# Altium schematic sheet PAGE2 - STM NUCLEO OTII TC.SchDoc
size A3
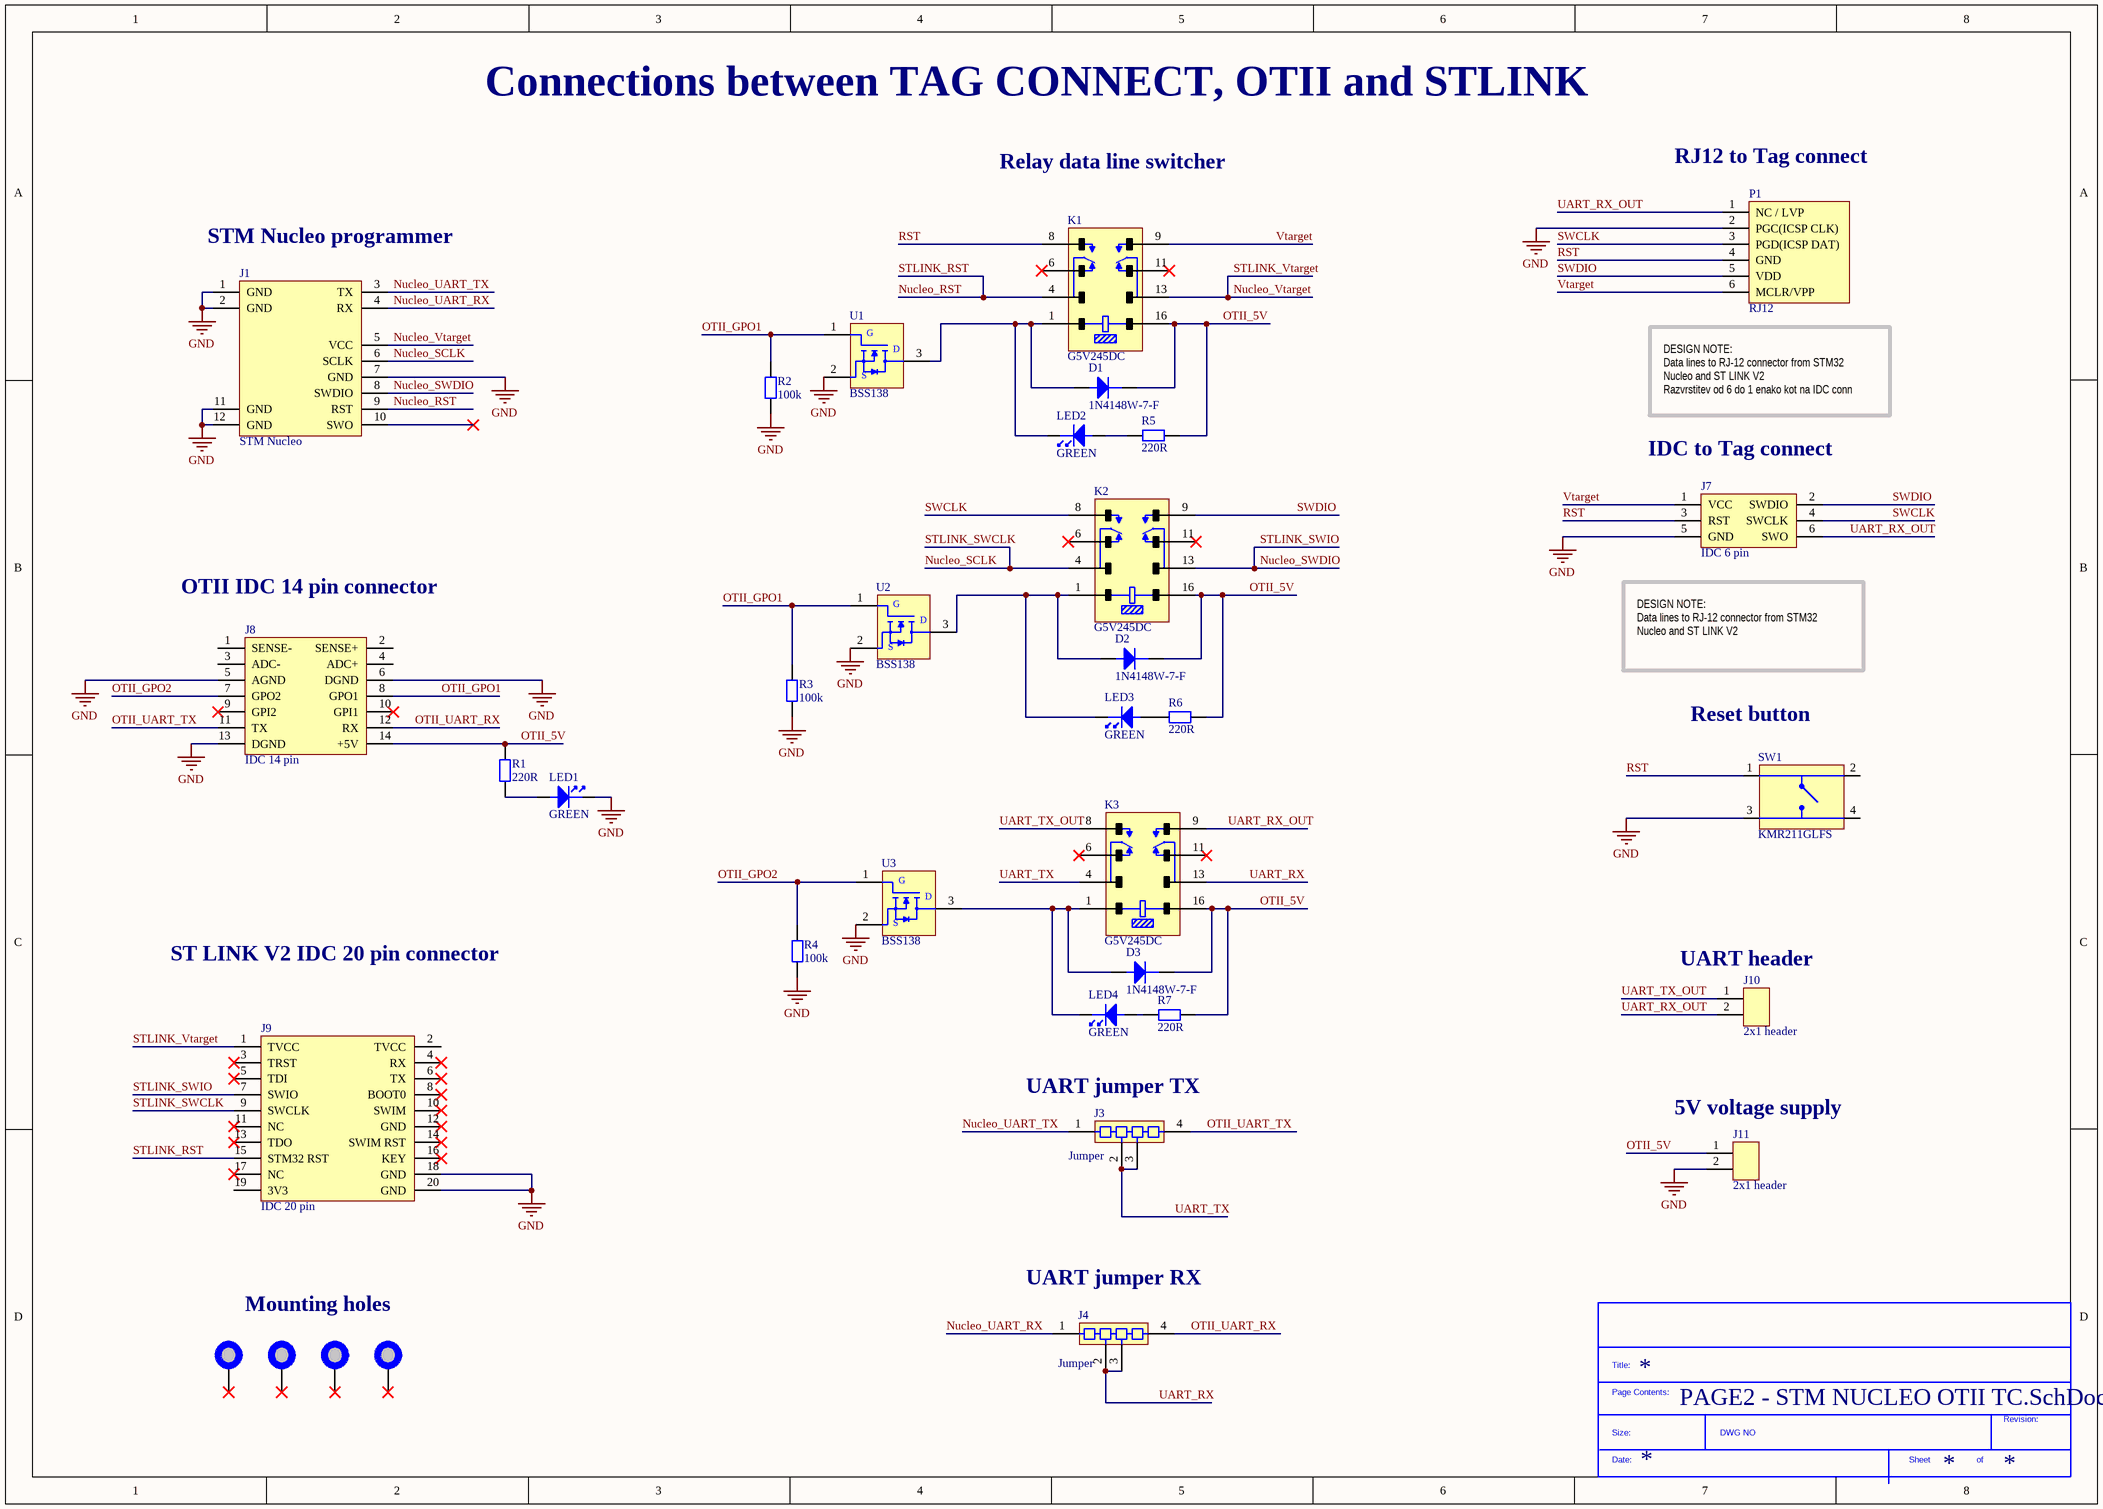
[diagram p0: PAGE2 - STM NUCLEO OTII TC.SchDoc]

## Parts
(Parts that share a designator on the sheet are numbered #1, #2 ... from top to bottom, then left to right.)
*#1  Mounting hole 3.3 mm  [MH_3.3]  (value not drawn)
*#2  Mounting hole 3.3 mm  [MH_3.3]  (value not drawn)
*#3  Mounting hole 3.3 mm  [MH_3.3]  (value not drawn)
*#4  Mounting hole 3.3 mm  [MH_3.3]  (value not drawn)
*?  SDTitleBlock  (value not drawn)  (graphical)
D1  1N4148W-7-F  [1N4148W-7-F]
D2  1N4148W-7-F  [1N4148W-7-F]
D3  1N4148W-7-F  [1N4148W-7-F]
J1  STM Nucleo  [NUCLEO F4 HEADERS]
J3  Jumper  [jumper4]
J4  Jumper  [jumper4]
J7  IDC 6 pin  [IDC 6 pin]
J8  IDC 14 pin  [IDC 14 PIN]
J9  IDC 20 pin  [IDC 20 pin]
J10  2x1 header  [2 pin]
J11  2x1 header  [2 pin]
K1  G5V245DC  [G5V245DC]
K2  G5V245DC  [G5V245DC]
K3  G5V245DC  [G5V245DC]
LED1  GREEN  [LED 0603]
LED2  GREEN  [LED 0603]
LED3  GREEN  [LED 0603]
LED4  GREEN  [LED 0603]
P1  RJ12  [RJ12]
R1  220R  [R0603]
R2  100k  [R0603]
R3  100k  [R0603]
R4  100k  [R0603]
R5  220R  [R0603]
R6  220R  [R0603]
R7  220R  [R0603]
SW1  KMR211GLFS  [Button]
U1  BSS138  [BSS138]
U2  BSS138  [BSS138]
U3  BSS138  [BSS138]

## Nets
GND: J1.1(GND) J1.2(GND) J1.7(GND) J1.11(GND) J1.12(GND) J7.5(GND) J8.5(AGND) J8.6(DGND) J8.13(DGND) J9.18(GND) J9.20(GND) J11.2 LED1.1(Cathode) P1.2(PGC(ICSP_CLK)) R2.1 R3.1 R4.1 SW1.3 U1.2(S) U2.2(S) U3.2(S)
Nucleo_RST: J1.9(RST) J9.15(STM32_RST) K1.4  [also labelled STLINK_RST]
Nucleo_SCLK: J1.6(SCLK) J9.9(SWCLK) K2.4  [also labelled STLINK_SWCLK]
Nucleo_SWDIO: J1.8(SWDIO) J9.7(SWIO) K2.13  [also labelled STLINK_SWIO]
Nucleo_UART_RX: J1.4(RX) J4.1
Nucleo_UART_TX: J1.3(TX) J3.1
Nucleo_Vtarget: J1.5(VCC) J9.1(TVCC) K1.13  [also labelled STLINK_Vtarget]
OTII_5V: D1.1(Cathode) D2.1(Cathode) D3.1(Cathode) J8.14(+5V) J11.1 K1.16 K2.16 K3.16 R1.2 R5.1 R6.1 R7.2
OTII_GPO1: J8.8(GPO1) R2.2 R3.2 U1.1(G) U2.1(G)
OTII_GPO2: J8.7(GPO2) R4.2 U3.1(G)
OTII_UART_RX: J4.4 J8.12(RX)
OTII_UART_TX: J3.4 J8.11(TX)
RST: J7.3(RST) K1.8 P1.4(GND) SW1.1
SWCLK: J7.4(SWCLK) K2.8 P1.3(PGD(ICSP_DAT))
SWDIO: J7.2(SWDIO) K2.9 P1.5(VDD)
UART_RX: J4.2 J4.3 K3.13
UART_RX_OUT: J7.6(SWO) J10.2 K3.9 P1.1(NC_/_LVP)
UART_TX: J3.2 J3.3 K3.4
UART_TX_OUT: J10.1 K3.8
Vtarget: J7.1(VCC) K1.9 P1.6(MCLR/VPP)
NetD1_2: D1.2(Anode) K1.1 LED2.1(Cathode) U1.3(D)
NetD2_2: D2.2(Anode) K2.1 LED3.1(Cathode) U2.3(D)
NetD3_2: D3.2(Anode) K3.1 LED4.1(Cathode) U3.3(D)
NetLED1_2: LED1.2(Anode) R1.1
NetLED2_2: LED2.2(Anode) R5.2
NetLED3_2: LED3.2(Anode) R6.2
NetLED4_2: LED4.2(Anode) R7.1

Not connected (* = marked no-connect by the designer): *#1 1*; *#2 1*; *#3 1*; *#4 1*; J1 10(SWO)*; J8 1(SENSE-) 2(SENSE+) 3(ADC-) 4(ADC+) 9(GPI2)* 10(GPI1)*; J9 2(TVCC) 3(TRST)* 4(RX)* 5(TDI)* 6(TX)* 8(BOOT0)* 10(SWIM)* 11(NC)* 12(GND)* 13(TDO)* 14(SWIM_RST)* 16(KEY)* 17(NC)* 19(3V3); K1 6* 11*; K2 6* 11*; K3 6* 11*; SW1 2 4

## Notes on the sheet
- Connections between TAG CONNECT, OTII and STLINK
- Relay data line switcher
- (near P1) RJ12 to Tag connect
- (near J1) STM Nucleo programmer
- (near P1) DESIGN NOTE:
  Data lines to RJ-12 connector from STM32 Nucleo and ST LINK V2
  Razvrstitev od 6 do 1 enako kot na IDC conn
- (near J7) IDC to Tag connect
- (near J8) OTII IDC 14 pin connector
- DESIGN NOTE:
  Data lines to RJ-12 connector from STM32 Nucleo and ST LINK V2
- (near SW1) Reset button
- ST LINK V2 IDC 20 pin connector
- (near J10) UART header
- (near J3) UART jumper TX
- (near J11) 5V voltage supply
- (near *#2) Mounting holes
- (near J4) UART jumper RX
- (in symbol SDTitleBlock) Title:; Page Contents:; Revision:; Size:; DWG NO; Date:; Sheet; of

## Library data of the parts
*#1-*#4 = MH_3_3
D1-D3 = 1N4148W-7-F: DIODE GEN PURP 100V 300MA SOD123; Manufacturer: Diodes; Current Rating: 150mA; Max Surge Current: 2A; Peak Reverse Current: 1uA; Recovery Time: 4ns; Forward Voltage: 1.25V; Power Dissipation: 400mW; Element Configuration: Single; Polarity: Standard; Voltage Rating (DC): 75V; Capacitance: 2pF; Supplier 1: Farnell; Manufacturer Part Number: 1N4148W-7-F; Stock 1: 994731; Pricing 1: 5=0.155, 25=0.151, 100=0.0525, 250=0.0496, 500=0.0474, 1000=0.0247, 5000=0.0213 (EUR); Mount: Surface Mount; Number of Pins: 2; Weight: 0.000353oz; Contact Plating: Tin,Matte; Min Operating Temperature: -65°C; Max Operating Temperature: 150°C; Package Quantity: 3000; Packaging: Tape and Reel; Voltage: 100V; Forward Current: 150mA; Average Rectified Current: 300mA; Reverse Recovery Time: 4ns; Max Repetitive Reverse Voltage (Vrrm): 100V; Max Forward Surge Current (Ifsm): 2A; Peak Non-Repetitive Surge Current: 2A; Power Rating: 400mW; Output Current: 150mA; Max Reverse Voltage (DC): 100V; Length: 2.85mm; Height: 1.25mm; Width: 1.7mm; Radiation Hardening: No; Lead Free: Lead Free; REACH SVHC: No SVHC; ComponentLink1URL: https://www.diodes.com/assets/Datasheets/ds30086.pdf?src-supplier=Digi-Key; ComponentLink1Description: https://www.diodes.com/assets/Datasheets/ds30086.pdf?src-supplier=Digi-Key; ComponentLink2URL: http://www.farnell.com/datasheets/1915529.pdf?src-supplier=Element14; ComponentLink2Description: http://www.farnell.com/datasheets/1915529.pdf?src-supplier=Element14; ComponentLink3URL: https://www.diodes.com/assets/Datasheets/ds30086.pdf?src-supplier=Avnet; ComponentLink3Description: https://www.diodes.com/assets/Datasheets/ds30086.pdf?src-supplier=Avnet; ComponentLink4URL: http://www.mouser.com/ds/2/115/ds30086-60872.pdf?src-supplier=Mouser; ComponentLink4Description: http://www.mouser.com/ds/2/115/ds30086-60872.pdf?src-supplier=Mouser; ComponentLink5URL: https://www.diodes.com/assets/Datasheets/ds30086.pdf?src-supplier=Avnet+Europe; ComponentLink5Description: https://www.diodes.com/assets/Datasheets/ds30086.pdf?src-supplier=Avnet+Europe; ComponentLink6URL: https://www.diodes.com/assets/Datasheets/ds30086.pdf?src-supplier=Verical; ComponentLink6Description: https://www.diodes.com/assets/Datasheets/ds30086.pdf?src-supplier=Verical; Supplier Part Number 1: 1776392
J3 J4 = Jumper_1: 4 pin jumper
J7 = 90130-1206: Headers & Wire Housings 2.54MM CGRIDIII HDR 6P V DR SHRD AU-E; Manufacturer: Molex; Number of Contacts: 6; Max Voltage Rating (DC): 350.35kV; Contact Resistance: 20mR; Max Voltage Rating (AC): 500V; Current Rating: 3A; Voltage Rating: 350V; Max Current Rating: 3.9A; Insulation Resistance: 5GR; Gender: Male; Glow Wire Compliant: Non-compliant; Supplier 1: Farnell; Manufacturer Part Number: 90130-1206; Stock 1: 1896; Pricing 1: 1=1.07, 50=1, 100=0.934, 250=0.84, 500=0.775, 1000=0.619 (EUR); Mount: Through Hole; Contact Plating: Gold; Contact Material: Brass,Bronze,Copper; Housing Color: Black; Color: Black; Housing Material: Polyester; Material: Glass,Polyester; Min Operating Temperature: -55°C; Max Operating Temperature: 125°C; Number of Rows: 2; Termination: Solder; Packaging: Tray; Number of Positions: 6; Orientation: Vertical; Package Quantity: 2560; Number of Poles: 6; Voltage Rating (AC): 350V; Contact Gender: Male; Working Voltage: 350V; Voltage Rating (DC): 350V; Number of Circuits: 6; Length: 8mm; Height: 4.7mm; Pitch: 2.54mm; Row Spacing: 2.54mm; Depth: 3.94mm; Lead Pitch: 2.54mm; Radiation Hardening: No; REACH SVHC: Unknown; Lead Free: Lead Free; ComponentLink1URL: http://www.mouser.com/ds/2/276/0901301206_PCB_HEADERS-151694.pdf?src-supplier=Mouser; ComponentLink1Description: http://www.mouser.com/ds/2/276/0901301206_PCB_HEADERS-151694.pdf?src-supplier=Mouser; ComponentLink2URL: http://www.jameco.com/Jameco/Products/ProdDS/1978810.pdf?src-supplier=Jameco; ComponentLink2Description: http://www.jameco.com/Jameco/Products/ProdDS/1978810.pdf?src-supplier=Jameco; ComponentLink3URL: http://www.molex.com/webdocs/datasheets/pdf/en-us/0901301206_PCB_HEADERS.pdf?src-supplier=Avnet+Europe; ComponentLink3Description: http://www.molex.com/webdocs/datasheets/pdf/en-us/0901301206_PCB_HEADERS.pdf?src-supplier=Avnet+Europe; ComponentLink4URL: http://www.molex.com/webdocs/datasheets/pdf/en-us/0901301206_PCB_HEADERS.pdf?src-supplier=Avnet; ComponentLink4Description: http://www.molex.com/webdocs/datasheets/pdf/en-us/0901301206_PCB_HEADERS.pdf?src-supplier=Avnet; ComponentLink5URL: http://uk.rs-online.com/webdocs/13c4/0900766b813c4c7b.pdf?src-supplier=RSComponents; ComponentLink5Description: http://uk.rs-online.com/webdocs/13c4/0900766b813c4c7b.pdf?src-supplier=RSComponents; Supplier Part Number 1: 9733884
J8 = 70246-1404: Conn Shrouded Header (4 Sides) HDR 14 POS 2.54mm Solder ST Thru-Hole C-Grid® Frame; Manufacturer: Molex; Number of Contacts: 14; Max Voltage Rating (DC): 250V; Current Rating: 2.5A; Gender: Male; Contact Post Length: 3.43mm; Glow Wire Compliant: Non-compliant; Supplier 1: Farnell; Manufacturer Part Number: 70246-1404; Stock 1: 3001; Pricing 1: 1=1.55, 50=1.48, 100=1.42, 250=1.29, 500=1.17, 1000=0.966 (EUR); Mount: Through Hole; Contact Plating: Gold,Tin; Contact Material: Bronze,Gold; Housing Material: Polyester; Min Operating Temperature: -55°C; Max Operating Temperature: 120°C; Number of Rows: 2; Termination: Solder; Packaging: Tray; Number of Positions: 14; Orientation: Vertical; Voltage Rating: 250V; Voltage Rating (DC): 250V; Contact Gender: Male; Number of Circuits: 14; Pitch: 2.54mm; Row Spacing: 2.54mm; Contact Mating Length: 6.1mm; Radiation Hardening: No; REACH SVHC: Unknown; ELV: Compliant; Flammability Rating: UL94 V-0; ComponentLink1URL: http://www.farnell.com/datasheets/2051710.pdf?src-supplier=Element14; ComponentLink1Description: http://www.farnell.com/datasheets/2051710.pdf?src-supplier=Element14; ComponentLink2URL: http://www.molex.com/webdocs/datasheets/pdf/en-us/0702461404_PCB_HEADERS.pdf?src-supplier=Avnet; ComponentLink2Description: http://www.molex.com/webdocs/datasheets/pdf/en-us/0702461404_PCB_HEADERS.pdf?src-supplier=Avnet; ComponentLink3URL: http://uk.rs-online.com/webdocs/13c4/0900766b813c492f.pdf?src-supplier=RSComponents; ComponentLink3Description: http://uk.rs-online.com/webdocs/13c4/0900766b813c492f.pdf?src-supplier=RSComponents; ComponentLink4URL: http://www.mouser.com/ds/2/276/0702461404_PCB_HEADERS-172392.pdf?src-supplier=Mouser; ComponentLink4Description: http://www.mouser.com/ds/2/276/0702461404_PCB_HEADERS-172392.pdf?src-supplier=Mouser; ComponentLink5URL: http://www.molex.com/webdocs/datasheets/pdf/en-us/0702461404_PCB_HEADERS.pdf?src-supplier=Avnet+Europe; ComponentLink5Description: http://www.molex.com/webdocs/datasheets/pdf/en-us/0702461404_PCB_HEADERS.pdf?src-supplier=Avnet+Europe; Supplier Part Number 1: 1392520
J9 = 70246-2004: Headers & Wire Housings 2.54mm CGrid Hdr Shr d /Slt .13AuLF 20Ckt; Manufacturer: Molex; Number of Contacts: 20; Max Voltage Rating (DC): 250V; Current Rating: 2.5A; Gender: Male; Glow Wire Compliant: Non-compliant; Supplier 1: Farnell; Manufacturer Part Number: 70246-2004; Stock 1: 2985; Pricing 1: 1=1.62, 50=1.52, 100=1.41, 250=1.28, 500=1.17, 1000=0.943 (EUR); Mount: Through Hole; Contact Plating: Gold; Contact Material: Gold,Bronze; Min Operating Temperature: -55°C; Max Operating Temperature: 120°C; Number of Rows: 2; Termination: Solder; Packaging: Tray; Number of Positions: 20; Orientation: Vertical; Package Quantity: 720; Voltage Rating (DC): 250V; Voltage Rating: 250V; Number of Circuits: 20; Pitch: 2.54mm; Radiation Hardening: No; REACH SVHC: Unknown; ELV: Compliant; Flammability Rating: UL94 V-0; ComponentLink1URL: http://www.farnell.com/datasheets/2051704.pdf?src-supplier=Element14; ComponentLink1Description: http://www.farnell.com/datasheets/2051704.pdf?src-supplier=Element14; ComponentLink2URL: http://www.mouser.com/ds/2/276/0702462004_PCB_HEADERS-150189.pdf?src-supplier=Mouser; ComponentLink2Description: http://www.mouser.com/ds/2/276/0702462004_PCB_HEADERS-150189.pdf?src-supplier=Mouser; ComponentLink3URL: http://www.molex.com/webdocs/datasheets/pdf/en-us/0702462004_PCB_HEADERS.pdf?src-supplier=Avnet+Europe; ComponentLink3Description: http://www.molex.com/webdocs/datasheets/pdf/en-us/0702462004_PCB_HEADERS.pdf?src-supplier=Avnet+Europe; ComponentLink4URL: http://www.molex.com/webdocs/datasheets/pdf/en-us/0702462004_PCB_HEADERS.pdf?src-supplier=Avnet; ComponentLink4Description: http://www.molex.com/webdocs/datasheets/pdf/en-us/0702462004_PCB_HEADERS.pdf?src-supplier=Avnet; ComponentLink5URL: http://uk.rs-online.com/webdocs/13c4/0900766b813c4938.pdf?src-supplier=RSComponents; ComponentLink5Description: http://uk.rs-online.com/webdocs/13c4/0900766b813c4938.pdf?src-supplier=RSComponents; Supplier Part Number 1: 1392410
J10 J11 = 2 pin header
K1-K3 = G5V245DC: OMRON ELECTRONIC COMPONENTS         G5V-2 4.5DC            Signal Relay, G5V-2 Series, DPDT, 4.5 VDC, 2 A, Through Hole, Non Latching; Contact Current Rating: 2A; Coil Resistance: 40R; Coil Power: 500mW; Coil Voltage (DC): 4.5V; Coil Type: Non-Latching; Supplier 1: Farnell; Manufacturer: Omron; Manufacturer Part Number: G5V245DC; Stock 1: 337; Pricing 1: 1=1.89, 25=1.76, 50=1.24, 250=1.14, 500=1.12 (EUR); Mount: PCB; Contact Material: Silver,Gold; Min Operating Temperature: -25°C; Max Operating Temperature: 65°C; Termination: Through Hole; Switching Current: 2A; Length: 20.5mm; Height: 11.5mm; Depth: 10.1mm; REACH SVHC: Unknown; ComponentLink1URL: http://www.farnell.com/datasheets/724502.pdf?src-supplier=Element14; ComponentLink1Description: http://www.farnell.com/datasheets/724502.pdf?src-supplier=Element14; ComponentLink2URL: https://www.distrelec.biz/Web/Downloads/_t/ds/g5v2_eng_tds.pdf?mime=application%2Fpdf&src-supplier=Distrelec; ComponentLink2Description: https://www.distrelec.biz/Web/Downloads/_t/ds/g5v2_eng_tds.pdf?mime=application%2Fpdf&src-supplier=Distrelec; Supplier Part Number 1: 9949810
LED1-LED4 = KP-1608CGCK: KINGBRIGHT - KP-1608CGCK - LED, 0603, 50MCD, GREEN; Lens Color: Clear; Viewing Angle: 120°; Lens Style: Rectangular,Diffused,Colorless; Dominant Wavelength: 570nm; Number of LEDs: 1; Forward Voltage: 2.1V; Forward Current: 20mA; Supplier 1: Farnell; Manufacturer: Kingbright; Manufacturer Part Number: KP-1608CGCK; Stock 1: 18535; Pricing 1: 5=0.157, 50=0.143, 100=0.0934, 500=0.0789, 1000=0.0621 (EUR); Mount: Surface Mount; Case/Package: 1608; Number of Pins: 2; Color: Green; Luminous Intensity: 50mcd; Wavelength: 570nm; Packaging: Tape and Reel; Length: 0.8mm; Height: 1.1mm; Width: 1.6mm; Radiation Hardening: No; REACH SVHC: No SVHC; ComponentLink1URL: http://www.farnell.com/datasheets/2045956.pdf?src-supplier=Element14; ComponentLink1Description: http://www.farnell.com/datasheets/2045956.pdf?src-supplier=Element14; ComponentLink2URL: http://www.rapidonline.com/pdf/72-8670.pdf?src-supplier=Rapid+Electronics; ComponentLink2Description: http://www.rapidonline.com/pdf/72-8670.pdf?src-supplier=Rapid+Electronics; Supplier Part Number 1: 2290328
P1 = 95501-2661: MODULAR, JACK, THT, R/A, RJ11, 6P6C; Manufacturer: Molex; Shielding: Unshielded; Max Voltage Rating (DC): 125V; Number of Ports: 1; Current Rating: 1.5A; Gender: Female; Number of Contacts: 6; Insulation Resistance: 500MR; Pitch: 2.54mm; Approvals: UL; Supplier 1: Farnell; Manufacturer Part Number: 95501-2661; Stock 1: 7441; Pricing 1: 10=0.565, 100=0.492, 500=0.443, 1000=0.394, 2500=0.356, 5000=0.344 (EUR); Mount: Through Hole; Contact Plating: Gold; Contact Material: Copper Alloy,Bronze; Housing Material: Thermoplastic; Color: Black; Insulation Material: Polyester; Min Operating Temperature: -40°C; Max Operating Temperature: 80°C; Packaging: Tray; Package Quantity: 3276; Termination: Through Hole; Orientation: Right Angle; Voltage Rating (DC): 125V; Number of Positions: 6; Length: 13.21mm; Depth: 18.1mm; Width: 11.5mm; REACH SVHC: Unknown; Halogen Free: Low Halogen; Lead Free: Lead Free; Flammability Rating: UL94 V-0; ComponentLink1URL: http://uk.rs-online.com/webdocs/13c4/0900766b813c4eac.pdf?src-supplier=RSComponents; ComponentLink1Description: http://uk.rs-online.com/webdocs/13c4/0900766b813c4eac.pdf?src-supplier=RSComponents; ComponentLink2URL: http://www.farnell.com/cad/1597654.pdf?src-supplier=Element14; ComponentLink2Description: http://www.farnell.com/cad/1597654.pdf?src-supplier=Element14; ComponentLink3URL: http://www.mouser.com/ds/2/276/0955012661_MODULAR_JACKS_PLUG-177638.pdf?src-supplier=Mouser; ComponentLink3Description: http://www.mouser.com/ds/2/276/0955012661_MODULAR_JACKS_PLUG-177638.pdf?src-supplier=Mouser; ComponentLink4URL: http://www.onlinecomponents.com/productFiles/mf-MOL/360890955012661_modular_jacks_plug.pdf?src-supplier=Onlinecomponents.com; ComponentLink4Description: http://www.onlinecomponents.com/productFiles/mf-MOL/360890955012661_modular_jacks_plug.pdf?src-supplier=Onlinecomponents.com; Supplier Part Number 1: 1536490
R1 R5-R7 = CRCW0603220RFKEA: RES SMD 220 OHM 1% 1/10W 0603; Manufacturer: Vishay; Temperature Coefficient: 100ppm/°C; Max Power Dissipation: 100mW; Voltage Rating: 75V; Supplier 1: Digi-Key; Manufacturer Part Number: CRCW0603220RFKEA; Stock 1: 0; Case/Package: 0603; Weight: 7.1E-05oz; Contact Plating: Tin; Case Code (Metric): 1608; Case Code (Imperial): 0603; Min Operating Temperature: -55°C; Max Operating Temperature: 155°C; Composition: Thick Film; Resistance: 220R; Tolerance: 1%; Packaging: Tape and Reel; Number of Terminations: 2; Power Rating: 100mW; Package Quantity: 10; Termination: SMD/SMT; Military Standard: Not; Voltage Rating (DC): 75V; Features: Automotive AEC-Q200; Length: 1.55mm; Height: 0.45mm; Width: 0.033inch; Depth: 0.85mm; Radiation Hardening: No; REACH SVHC: Unknown; Lead Free: Lead Free; ComponentLink1URL: http://www.vishay.com/docs/20035/dcrcwe3.pdf?src-supplier=Digi-Key; ComponentLink1Description: http://www.vishay.com/docs/20035/dcrcwe3.pdf?src-supplier=Digi-Key; ComponentLink2URL: http://www.mouser.com/ds/2/427/dcrcwe3-109170.pdf?src-supplier=Mouser; ComponentLink2Description: http://www.mouser.com/ds/2/427/dcrcwe3-109170.pdf?src-supplier=Mouser; ComponentLink3URL: http://www.farnell.com/datasheets/2045673.pdf?src-supplier=Element14; ComponentLink3Description: http://www.farnell.com/datasheets/2045673.pdf?src-supplier=Element14; ComponentLink4URL: http://www.vishay.com/docs/20035/dcrcwe3.pdf?src-supplier=Avnet; ComponentLink4Description: http://www.vishay.com/docs/20035/dcrcwe3.pdf?src-supplier=Avnet; ComponentLink5URL: http://www.vishay.com/docs/20035/dcrcwe3.pdf?src-supplier=Future+Electronics; ComponentLink5Description: http://www.vishay.com/docs/20035/dcrcwe3.pdf?src-supplier=Future+Electronics; ComponentLink6URL: http://uk.rs-online.com/webdocs/0d98/0900766b80d98afc.pdf?src-supplier=RSComponents; ComponentLink6Description: http://uk.rs-online.com/webdocs/0d98/0900766b80d98afc.pdf?src-supplier=RSComponents; ComponentLink7URL: https://www.alliedelec.com/m/d/0c934d6939ccefa68dbe0b96d821c8cf.pdf?src-supplier=Allied+Electronics; ComponentLink7Description: https://www.alliedelec.com/m/d/0c934d6939ccefa68dbe0b96d821c8cf.pdf?src-supplier=Allied+Electronics; ComponentLink8URL: https://www.verical.com/server-webapp/html/getDatasheet?partID=45816&src-supplier=Verical; ComponentLink8Description: https://www.verical.com/server-webapp/html/getDatasheet?partID=45816&src-supplier=Verical; ComponentLink9URL: http://www.vishay.com/docs/20035/dcrcwe3.pdf?src-supplier=Avnet+Europe; ComponentLink9Description: http://www.vishay.com/docs/20035/dcrcwe3.pdf?src-supplier=Avnet+Europe; ComponentLink10URL: https://www.distrelec.biz/Web/Downloads/a_/en/flD-CRCW-e3_data_en.pdf?mime=application%2Fpdf&src-supplier=Distrelec; ComponentLink10Description: https://www.distrelec.biz/Web/Downloads/a_/en/flD-CRCW-e3_data_en.pdf?mime=application%2Fpdf&src-supplier=Distrelec; ComponentLink11URL: http://www.farnell.com/datasheets/2111203.pdf?src-supplier=Element14; ComponentLink11Description: http://www.farnell.com/datasheets/2111203.pdf?src-supplier=Element14; Supplier Part Number 1: 541-220HTR-ND
R2-R4 = CPF-A-0603B100KE1: TE CONNECTIVITY         CPF-A-0603B100KE1             SMD Chip Resistor, Thin Film, 100 kohm, 50 V, 0603 [1608 Metric], 62.5 mW,  0.1%, CPF-A Series; Resistance: 100kR; Power Rating: 63mW; Voltage Rating: 50V; Temperature Coefficient: 25ppm/°C; Number of Resistors: 1; Supplier 1: Farnell; Manufacturer: TE Connectivity; Manufacturer Part Number: CPF-A-0603B100KE1; Stock 1: 5473; Pricing 1: 1=0.378, 50=0.279, 100=0.21, 250=0.199, 500=0.173, 1000=0.137, 5000=0.111 (EUR); Mount: Surface Mount; Case/Package: 0603; Case Code (Metric): 1608; Case Code (Imperial): 0603; Min Operating Temperature: -55°C; Max Operating Temperature: 155°C; Packaging: Tape and Reel; Composition: Thin Film; Tolerance: 0.1%; Voltage Rating (DC): 50V; Number of Terminations: 2; Termination: Solder; Features: Moisture Resistant,Automotive AEC-Q200,Anti-Sulfur; Max Power Dissipation: 63mW; REACH SVHC: No SVHC; ELV: Compliant; Supplier Part Number 1: 2483881
SW1 = KMR211GLFS: SWITCH TACTILE SPST-NO 0.05A 32V; Manufacturer: ITT C&K; Mechanical Life: 200000Cycles; Operating Force: 1.2N; Throw Configuration: SPST; Max Current Rating: 50mA; Power Rating: 1W; Illumination Type: Non-Illuminated,Illuminated; Switch Travel: 0.2mm; Switch Function: Off-Mom; Actuator Type: Standard; Actuator Length: 0.5mm; Supplier 1: Farnell; Manufacturer Part Number: KMR211GLFS; Stock 1: 0; Mount: Surface Mount; Contact Material: Silver; Contact Plating: Silver; Min Operating Temperature: -40°C; Max Operating Temperature: 85°C; Max Voltage Rating (DC): 32V; Termination: Gull Wing; Packaging: Tape and Reel; Orientation: Straight; Contact Current Rating: 50mA; Voltage Rating (DC): 32V; Package Quantity: 1; Current Rating: 50mA; Length: 2.8mm; Depth: 4.6mm; Width: 2.8mm; Radiation Hardening: No; REACH SVHC: No SVHC; Lead Free: Lead Free; ComponentLink1URL: http://uk.rs-online.com/webdocs/129c/0900766b8129c9f0.pdf?src-supplier=RSComponents; ComponentLink1Description: http://uk.rs-online.com/webdocs/129c/0900766b8129c9f0.pdf?src-supplier=RSComponents; ComponentLink2URL: http://www1.futureelectronics.com/doc/C%20-%20K%20COMPONENTS/KMR211GLFS.pdf?src-supplier=Future+Electronics; ComponentLink2Description: http://www1.futureelectronics.com/doc/C%20-%20K%20COMPONENTS/KMR211GLFS.pdf?src-supplier=Future+Electronics; ComponentLink3URL: http://www.farnell.com/datasheets/2044619.pdf?src-supplier=Element14; ComponentLink3Description: http://www.farnell.com/datasheets/2044619.pdf?src-supplier=Element14; ComponentLink4URL: http://www.ck-components.com/14414/kmr2_9aug12.pdf/?src-supplier=Avnet; ComponentLink4Description: http://www.ck-components.com/14414/kmr2_9aug12.pdf/?src-supplier=Avnet; ComponentLink5URL: http://www.ck-components.com/14414/kmr2_9aug12.pdf/?src-supplier=Avnet+Europe; ComponentLink5Description: http://www.ck-components.com/14414/kmr2_9aug12.pdf/?src-supplier=Avnet+Europe; ComponentLink6URL: https://www.ckswitches.com/media/1479/kmr2.pdf?src-supplier=Digi-Key; ComponentLink6Description: https://www.ckswitches.com/media/1479/kmr2.pdf?src-supplier=Digi-Key; ComponentLink7URL: http://www.ckswitches.com/media/1479/kmr2.pdf?src-supplier=Onlinecomponents.com; ComponentLink7Description: http://www.ckswitches.com/media/1479/kmr2.pdf?src-supplier=Onlinecomponents.com; Supplier Part Number 1: 1437635RL
U1-U3 = BSS138: MOSFET N-CH 50V 220MA SOT-23; Manufacturer: ON Semiconductor / Fairchild; Rds On Max: 3.5R; Input Capacitance: 27pF; Nominal Vgs: 1.3V; Number of Elements: 1; Max Power Dissipation: 360mW; Rise Time: 9ns; Turn-Off Delay Time: 20ns; Turn-On Delay Time: 2.5ns; Element Configuration: Single; Gate to Source Voltage (Vgs): 20V; On-State Resistance: 6R; Supplier 1: Farnell; Manufacturer Part Number: BSS138; Stock 1: 727806; Pricing 1: 5=0.286, 50=0.261, 100=0.143, 500=0.0495, 1500=0.0464 (EUR); Mount: Surface Mount; Case/Package: SOT-23; Number of Pins: 3; Weight: 0.03g; Contact Plating: Tin,Matte; Min Operating Temperature: -55°C; Max Operating Temperature: 150°C; Packaging: Tape and Reel; Package Quantity: 1; Dual Supply Voltage: 50V; Drain to Source Voltage (Vdss): 50V; Continuous Drain Current (ID): 220mA; Drain to Source Breakdown Voltage: 50V; Fall Time: 9ns; Drain to Source Resistance: 3.5R; Power Dissipation: 360mW; Threshold Voltage: 1.3V; Termination: SMD/SMT; Voltage Rating (DC): 50V; Current Rating: 220mA; Length: 2.92mm; Height: 0.93mm; Width: 1.3mm; Radiation Hardening: No; REACH SVHC: No SVHC; Lead Free: Lead Free; ComponentLink1URL: https://www.fairchildsemi.com/package-drawings/MA/MA03B.pdf?src-supplier=Digi-Key; ComponentLink1Description: https://www.fairchildsemi.com/package-drawings/MA/MA03B.pdf?src-supplier=Digi-Key; ComponentLink2URL: http://www.farnell.com/datasheets/2163920.pdf?src-supplier=Element14; ComponentLink2Description: http://www.farnell.com/datasheets/2163920.pdf?src-supplier=Element14; ComponentLink3URL: http://www.farnell.com/datasheets/2304519.pdf?src-supplier=Newark; ComponentLink3Description: http://www.farnell.com/datasheets/2304519.pdf?src-supplier=Newark; ComponentLink4URL: https://www.fairchildsemi.com/datasheets/BS/BSS138.pdf?src-supplier=Avnet; ComponentLink4Description: https://www.fairchildsemi.com/datasheets/BS/BSS138.pdf?src-supplier=Avnet; ComponentLink5URL: http://www.farnell.com/datasheets/193736.pdf?src-supplier=Element14; ComponentLink5Description: http://www.farnell.com/datasheets/193736.pdf?src-supplier=Element14; ComponentLink6URL: http://www.fairchildsemi.com/ds/BS/BSS138.pdf?src-supplier=Future+Electronics; ComponentLink6Description: http://www.fairchildsemi.com/ds/BS/BSS138.pdf?src-supplier=Future+Electronics; ComponentLink7URL: http://www.jameco.com/Jameco/Products/ProdDS/784896.pdf?src-supplier=Jameco; ComponentLink7Description: http://www.jameco.com/Jameco/Products/ProdDS/784896.pdf?src-supplier=Jameco; ComponentLink8URL: http://www.fairchildsemi.com/ds/BS/BSS138.pdf?src-supplier=Avnet+Europe; ComponentLink8Description: http://www.fairchildsemi.com/ds/BS/BSS138.pdf?src-supplier=Avnet+Europe; Supplier Part Number 1: 9845330